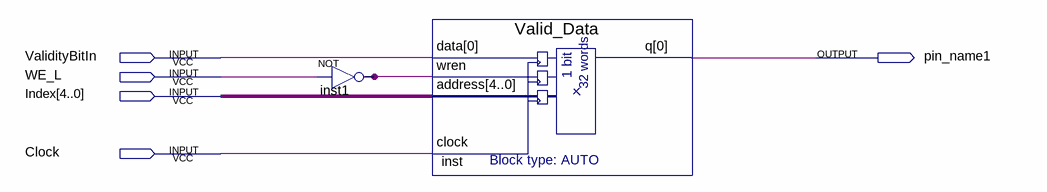
[diagram p0: schematic sheet]
// Quartus schematic Valid.bdf as structural Verilog: 2 symbols, 5 pins
module Valid (
  input  ValidityBitIn,
  input  WE_L,
  input  [4:0] Index,
  input  Clock,
  output pin_name1
);

  wire inst1_out;

  not inst1 (inst1_out, WE_L);
  Valid_Data inst (.data(ValidityBitIn), .wren(inst1_out), .address(Index), .clock(Clock), .q(pin_name1));
endmodule
